# Altium project soldering_station_controls.PrjPCB
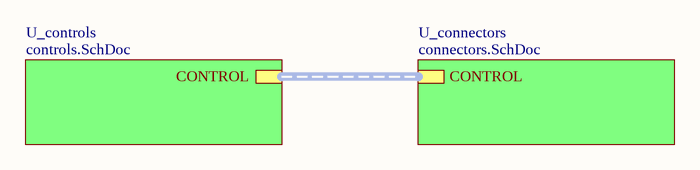
[diagram p0: top.SchDoc]
3 sheets, 17 parts. Net scope: hierarchical (ports join the sheet entries above them; power ports are global).
Board file: soldering_station_controls.PcbDoc
Sheets:
  top.SchDoc
    U_controls = controls.SchDoc
    U_connectors = connectors.SchDoc

## Sheet top.SchDoc
size A4

### Sub-sheets
U_connectors = connectors.SchDoc: CONTROL (harness CONTROL)
U_controls = controls.SchDoc: CONTROL (harness CONTROL)

### Buses and harness runs
harness sheet U_connectors/CONTROL = sheet U_controls/CONTROL

## Sheet controls.SchDoc
size A4
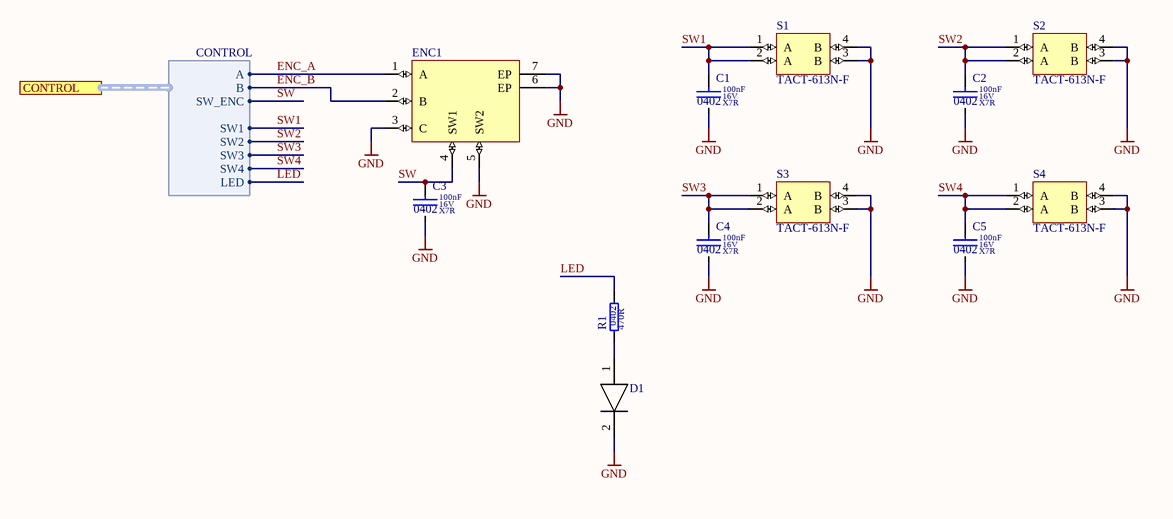
[diagram p1: controls.SchDoc]

### Parts
C1  value 100nF  Dielectric: X7R  Voltage: 16V  SCH_Footprint: 0402  [C_0402_1005]  (hidden comment: Ceramic X7R)
C2  value 100nF  Dielectric: X7R  Voltage: 16V  SCH_Footprint: 0402  [C_0402_1005]  (hidden comment: Ceramic X7R)
C3  value 100nF  Dielectric: X7R  Voltage: 16V  SCH_Footprint: 0402  [C_0402_1005]  (hidden comment: Ceramic X7R)
C4  value 100nF  Dielectric: X7R  Voltage: 16V  SCH_Footprint: 0402  [C_0402_1005]  (hidden comment: Ceramic X7R)
C5  value 100nF  Dielectric: X7R  Voltage: 16V  SCH_Footprint: 0402  [C_0402_1005]  (hidden comment: Ceramic X7R)
D1  LED_5mm  [LED_5mm]  (value not drawn)
ENC1  Wurth Elektronik 482016514001  [ENCODER]  (value not drawn)
R1  value 470R  SCH_Footprint: 0402  [R_0402_1005]  (hidden comment: Resistor)
S1  TACT-613N-F  [TACT-613N-F]
S2  TACT-613N-F  [TACT-613N-F]
S3  TACT-613N-F  [TACT-613N-F]
S4  TACT-613N-F  [TACT-613N-F]

### Ports
CONTROL (harness CONTROL)

### Harnesses
CONTROL: A, B, SW_ENC, SW1, SW2, SW3, SW4, LED

### Nets
GND: C1.2 C2.2 C3.2 C4.2 C5.2 D1.2(Cathode) ENC1.3(C) ENC1.5(SW2) ENC1.6(EP) ENC1.7(EP) S1.3(B) S1.4(B) S2.3(B) S2.4(B) S3.3(B) S3.4(B) S4.3(B) S4.4(B)
ENC_A: ENC1.1(A) ; port CONTROL.A
ENC_B: ENC1.2(B) ; port CONTROL.B
LED: R1.2 ; port CONTROL.LED
SW: C3.1 ENC1.4(SW1) ; port CONTROL.SW_ENC
SW1: C1.1 S1.1(A) S1.2(A) ; port CONTROL.SW1
SW2: C2.1 S2.1(A) S2.2(A) ; port CONTROL.SW2
SW3: C4.1 S3.1(A) S3.2(A) ; port CONTROL.SW3
SW4: C5.1 S4.1(A) S4.2(A) ; port CONTROL.SW4
NetD1_1: D1.1(Anode) R1.1

### Library data of the parts
C1-C5 = C_100nF_16V_X7R_0402_10: Capacitor; Manufacturer: Murata; Manufacturer Part Number: GRM155R71C104KA88D; Tolerance (%): 10; Part Number: C_100nF_16V_X7R_0402_10; HelpURL: https://www.mouser.com/ds/2/281/c02e-2905.pdf; Supplier 1: TME; Supplier 2: RS Components; Supplier 3: Farnell; Supplier 4: Mouser; Supplier Part Number 4: 81-GRM155R71C104KA88; Supplier 5: Digi-Key
D1 = LED_5mm: LED_5mm Diameter
ENC1 = ENCODER
R1 = R_470R_0402_1: Manufacturer: Yageo; Manufacturer Part Number: RC0402FR-07470RL; Voltage: 50V; Power: 63mW; Tolerance: 1%; Part Number: R_470R_0402_1; HelpURL: http://datasheet.octopart.com/RC0402FR-07470RL-Yageo-datasheet-10408619.pdf; Supplier 1: TME; Supplier Part Number 1: RC0402FR-07470R; Supplier 2: RS Components; Supplier 3: Farnell; Supplier Part Number 3: 9239197; Supplier 4: Mouser; Supplier Part Number 4: 603-RC0402FR-07470RL; Supplier 5: Digi-Key; Supplier Part Number 5: 311-470LRCT-ND

## Sheet connectors.SchDoc
size A4
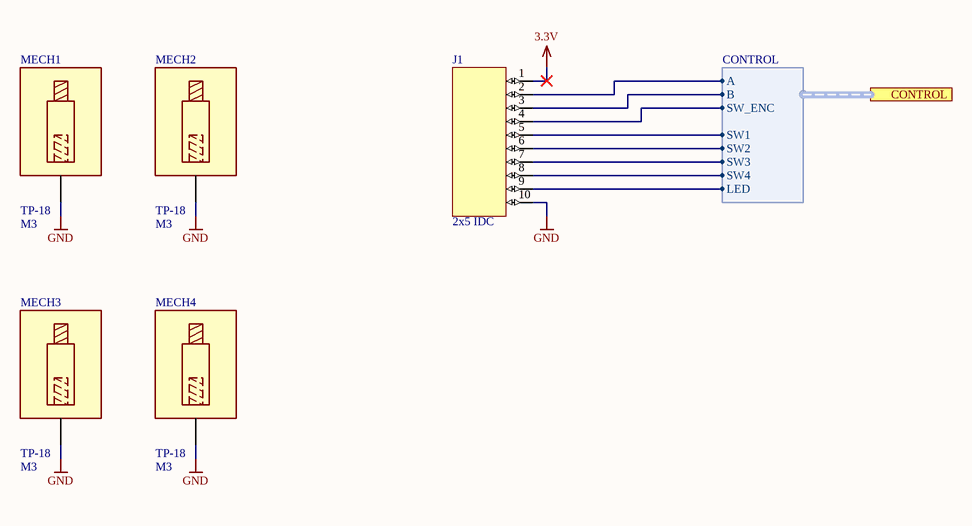
[diagram p2: connectors.SchDoc]

### Parts
J1  2x5 IDC  [IDC_2x5]
MECH1  value TP-18  SCH_Footprint: M3  [MECH_SPACER_MALE_FEMALE_18MM_M3]  (hidden comment: M3X0.5)
MECH2  value TP-18  SCH_Footprint: M3  [MECH_SPACER_MALE_FEMALE_18MM_M3]  (hidden comment: M3X0.5)
MECH3  value TP-18  SCH_Footprint: M3  [MECH_SPACER_MALE_FEMALE_18MM_M3]  (hidden comment: M3X0.5)
MECH4  value TP-18  SCH_Footprint: M3  [MECH_SPACER_MALE_FEMALE_18MM_M3]  (hidden comment: M3X0.5)

### Ports
CONTROL (harness CONTROL)

### Harnesses
CONTROL: A, B, SW_ENC, SW1, SW2, SW3, SW4, LED

### Nets
3.3V: J1.1
GND: J1.10 MECH1.1 MECH2.1 MECH3.1 MECH4.1
ENC_A: J1.2 ; port CONTROL.A
ENC_B: J1.3 ; port CONTROL.B
LED: J1.9 ; port CONTROL.LED
SW: J1.4 ; port CONTROL.SW_ENC
SW1: J1.5 ; port CONTROL.SW1
SW2: J1.6 ; port CONTROL.SW2
SW3: J1.7 ; port CONTROL.SW3
SW4: J1.8 ; port CONTROL.SW4

### Library data of the parts
J1 = IDC_2x5: 2x5 IDC Header
MECH1-MECH4 = MECH_SPACER_MALE_FEMALE_18MM_M3: Manufacturer: FIX&FASTEN; Part Number: MECH_SPACER_MALE_FEMALE_18MM_M3; HelpURL: http://www.tme.eu/pl/Document/c63f116060195082d899531b8f30ddf7/TP-10.pdf; Manufacturer Part Number: TP-18; Supplier 1: TME; Supplier Part Number 1: TP-18; Supplier 2: RS Components; Supplier 3: Farnell; Supplier 4: Mouser; Supplier 5: Digi-Key

## Nets that join several sheets
GND: controls (18 pins), connectors (5 pins)
ENC_A: controls (ENC1.1), connectors (J1.2)
ENC_B: controls (ENC1.2), connectors (J1.3)
LED: controls (R1.2), connectors (J1.9)
SW: controls (C3.1 ENC1.4), connectors (J1.4)
SW1: controls (C1.1 S1.1 S1.2), connectors (J1.5)
SW2: controls (C2.1 S2.1 S2.2), connectors (J1.6)
SW3: controls (C4.1 S3.1 S3.2), connectors (J1.7)
SW4: controls (C5.1 S4.1 S4.2), connectors (J1.8)